# Altium schematic sheet Sheet1.SchDoc
size A4; DocumentNumber: 1; SheetNumber: 1; SheetTotal: 2
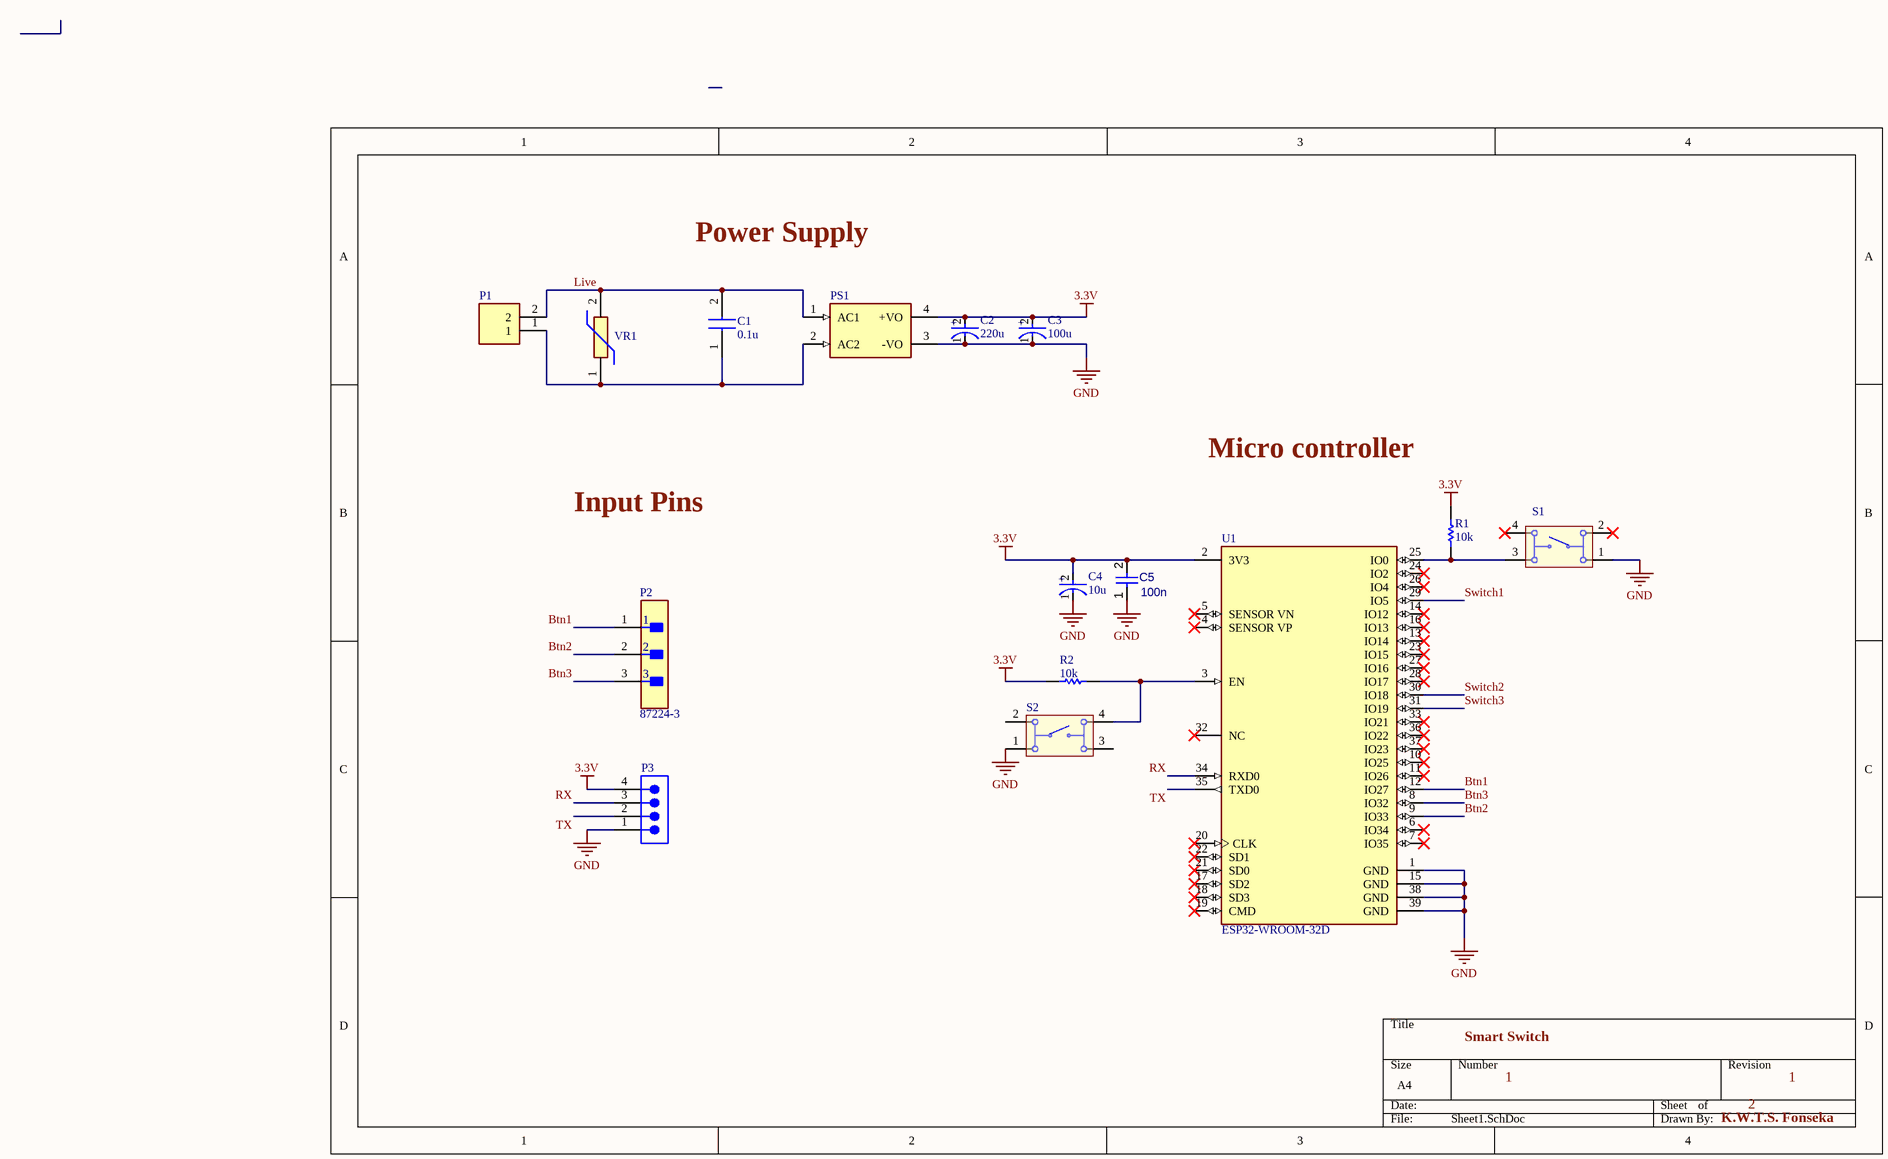
[diagram p0: Sheet1.SchDoc]

## Parts
C1  0.1u  [B32922X_(18_X_5)]
C2  220u  [FP-RAD-TH-D_6_3_0_5-L_11-MFG]
C3  100u  [FP-UKL1A101KED1TD-MFG]
C4  10u  [FP-T491A106M010AT-MFG]
C5  100n  [CAPC2013X95X50LL10T25]
P1  282841-2  [TE_282841-2]  (value not drawn)
P2  87224-3  [FP-87224-3-MFG]
P3  TSW-104-08-L-S  [SMTC-TSW-104-08-X-S]  (value not drawn)
PS1  HLK-PM03  [CONV_HLK-PM03]  (value not drawn)
R1  10k  [RESC2013X70X40ML20T20]
R2  10k  [RESC2013X70X40ML20T20]
S1  430471025826  [430471025826]  (value not drawn)
S2  430471025826  [430471025826]  (value not drawn)
U1  ESP32-WROOM-32D  [FP-ESP32-WROOM-32D-MFG]
VR1  MOV-10D561K  [MOV10D561K]  (value not drawn)

## Nets
3.3V: C2.2(A) C3.2(A) C4.2(A) C5.2 P3.4 PS1.4(+VO) R1.2 R2.1 U1.2(3V3)
GND: C2.1(C) C3.1(C) C4.1(C) C5.1 P3.1 PS1.3(-VO) S1.1 S2.1 U1.1(GND) U1.15(GND) U1.38(GND) U1.39(GND)
Btn1: P2.1 U1.12(IO27)
Btn2: P2.2 U1.9(IO33)
Btn3: P2.3 U1.8(IO32)
Live: C1.2 P1.2 PS1.1(AC1) VR1.2
RX: P3.3 U1.34(RXD0)
Switch1: U1.29(IO5)
Switch2: U1.30(IO18)
Switch3: U1.31(IO19)
TX: P3.2 U1.35(TXD0)
NetC1_1: C1.1 P1.1 PS1.2(AC2) VR1.1
NetR1_1: R1.1 S1.3 U1.25(IO0)
NetR2_2: R2.2 S2.4 U1.3(EN)

Not connected (* = marked no-connect by the designer): S1 2* 4*; S2 2 3; U1 4(SENSOR_VP)* 5(SENSOR_VN)* 6(IO34)* 7(IO35)* 10(IO25)* 11(IO26)* 13(IO14)* 14(IO12)* 16(IO13)* 17(SD2)* 18(SD3)* 19(CMD)* 20(CLK)* 21(SD0)* 22(SD1)* 23(IO15)* 24(IO2)* 26(IO4)* 27(IO16)* 28(IO17)* 32(NC)* 33(IO21)* 36(IO22)* 37(IO23)*

## Notes on the sheet
- Power Supply
- Micro controller
- Input Pins
- Smart Switch
- 1
- K.W.T.S. Fonseka
- (in symbol CMP-03017-000010-1) +
- (in symbol CMP-05427-001329-1) +
- (in symbol CMP-12462-000006-1) +

## Library data of the parts
C1 = B32922X2104K000: Safety Capacitor; Manufacturer_Name: TDK; Datasheet Link: https://product.tdk.com/system/files/dam/doc/product/capacitor/film/emi/data_sheet/20/20/db/fc_2009/x2_b32921_923_xy.pdf; Height: 10.5mm; Manufacturer_Part_Number: B32922X2104K000; Mouser Part Number: 871-B32922X2104K000; Mouser Price/Stock: https://www.mouser.co.uk/ProductDetail/EPCOS-TDK/B32922X2104K000?qs=TuK3vfAjtkWDVip5zaCELA%3D%3D; Arrow Part Number: B32922X2104K000; Arrow Price/Stock: https://www.arrow.com/en/products/b32922x2104k000/epcos-tdk?region=nac
C2 = CMP-05427-001329-1: Aluminum Electrolytic Capacitors (Radial Lead Type) 220uF ±20% 10V; Ripple Current: 455mA; Dielectric Material: Aluminium; Leakage Current: 10nA; Life (Hours): 2000Hour; Impedance: 130mR; Dissipation Factor: 0.19%; Lead Diameter: 0.5mm; Lead Length: 17mm; Outside Diameter: 6mm; Contact Plating: Tin; Lead Pitch: 2.5mm; Voltage: 10V; Max Operating Temperature: 105°C; Termination: Radial; Mount: Through Hole; Height: 11.2mm; RoHS Compliant: Yes; Voltage Rating (DC): 10V; Number of Pins: 2; Case/Package: Radial; Diameter: 6mm; ESR (Equivalent Series Resistance): 130mR; Construction: RADIAL; Lead Free: Lead Free; Min Operating Temperature: -40°C; Height - Seated (Max): 0.5inch; Capacitance: 220uF; Radiation Hardening: No; Voltage Rating: 10V; Length: 11mm; Ripple Current (AC): 455mA; Package Quantity: 200; Packaging: Bulk; Tolerance: 20%; Series: FM
C3 = CMP-12462-000006-1: CAP ALUM 100UF 10% 10V RADIAL; Manufacturer: Nichicon; Manufacturer Part Number: UKL1A101KED1TD; Dissipation Factor: 15%; Life: 2000Hours; Ripple Current: 180mA; Material: Aluminum; Leakage Current: 2uA; ComponentLink2Description: Datasheet; Value: 100uF; Digikey Description: CAP ALUM 100UF 10% 10V RADIAL; Temperature Range High: +85°C; RoHS: TRUE; Tolerance: 10%; Category: Cap; Device Class L1: Passive Components; Device Class L2: Capacitors; Package: 0; Height: 12mm; Octopart: https://octopart.com/ukl1a101ked1td-nichicon-20309866; Temperature: -40°C to +85°C; Capacitance: 100uF; Temperature Range Low: -40°C; Lead Free: Yes; Voltage Rating: 10V; Device Class L3: Aluminum Electrolytic Capacitors; ComponentLink2URL: https://www.nichicon.co.jp/english/products/pdfs/e-ukl.pdf; Automotive: No
C4 = CMP-03017-000010-1: CAP TANT 10UF 20% 10V 1206; Leakage Current: 1uA; Dissipation Factor: 6%; Dielectric Material: Tantalum; Polarity: Polar; Life (Hours): 2000Hour; ESR (Equivalent Series Resistance): 4R; Number of Pins: 2; Package Quantity: 2000; Depth: 1.6mm; Radiation Hardening: No; Mount: Surface Mount; Case/Package: 1206; Features: General Purpose; Case Code (Imperial): 1206; Voltage Rating: 10V; Series: T491; Case Code (Metric): 3216; Height: 1.6mm; Voltage Rating (DC): 10V; Width: 0.063inch; Lead Pitch: 1.2mm; Length: 3.2mm; Height - Seated (Max): 0.071inch; Capacitance: 10uF; Size: 1.6mm; Min Operating Temperature: -55°C; Packaging: Tape and Reel; Weight: 0.000571oz; Construction: Flat; Voltage: 10V; Tolerance: 20%; Termination: SMD/SMT; Max Operating Temperature: 125°C; Lead Free: Lead Free; REACH SVHC: No SVHC; RoHS Compliant: Yes
C5 = CMP-001-00018-6: Chip Capacitor, 100 nF, +/- 10%, 50 V, 0805 (2012 Metric); Voltage Rating: 50V; Value: 100nF; Capacitor Type: Ceramic; Case/Package: 0805; Min Operating Temperature: -55°C; Tolerance: 10%; RoHS Compliant: True; Max Operating Temperature: 125°C; Pins: 2; Mounting Technology: SM
P1 = CMP-002-00071-1: Conn Terminal Block 2 POS 5.08mm Solder ST Thru-Hole 17.5A/Contact; MF: TE Connectivity; Source: 282841-2.SchLib; Price: None; Purchase-URL: https://pricing.snapeda.com/search/part/282841-2/?ref=eda; MP: 282841-2; Value: *; EU_RoHS_Compliance: Compliant with Exemptions; Case/Package: None; SnapEDA_Link: https://www.snapeda.com/parts/282841-2/TE+Connectivity+AMP+Connectors/view-part/?ref=snap; Design Item ID: 282841-2; Component Type: Standard; Pins: 2; Check_prices: https://www.snapeda.com/parts/282841-2/TE+Connectivity+AMP+Connectors/view-part/?ref=eda; Availability: In Stock
P2 = CMP-2000-05697-2: CONN HEADER VERT 3POS 2.54MM; Number of Positions: 3; Gasket: No (Without); High Speed Serial Data Connector: No; Current Rating: 3A; Contact Post Length: 0.125inch; PCB Thickness: 1.397mm; PCB Mount Retention: Without; Connector Type: Plug; Approvals: CSA; PCB Mounting Orientation: Vertical; Pitch: 2.54mm; Mating Alignment: No (Without); Housing Color: Black; Contact Gender: Male; Length: 7.21mm; Max Operating Temperature: 105°C; Strain Relief: No (Without); Contact Material: Bronze; Row Spacing: 2.54mm; Series: AMPMODU MOD II; Board Standoff: No (Without); Package Quantity: 520; Radiation Hardening: No; Contact Protection: No (Without); Stabilizers: No (Without); Number of Rows: 1; Contact Mating Length: 8.08mm; Contact Shape: Square; Depth: 2.54mm; Contact Current Rating: 3A; Flammability Rating: UL94 V-0; Packaging: Carton; Number of Contacts: 3; Orientation: Straight; Mount: Through Hole; Keyed: No; Contact Type: Male Pin; Housing Material: Thermoplastic; High Temperature Housing: No; ELV: Compliant; Contact Plating: Gold; Termination: Through Hole; Selectively Loaded: No (Without); Lead Free: Lead Free; Min Operating Temperature: -65°C; Mating Connector Lock: No (Without); Color: Black; RoHS Compliant: Yes
P3 = CMP-1024-00358-1: 0.025" SQ Post Header, Through-hole, Vertical, -55 to 125 degC, 2.54 mm Pitch, 4-Pin, Male, RoHS; Manufacturer: Samtec; Pitch: 2.54 mm; PartNumber: TSW-104-08-L-S; RoHS: True; Temperature Range: -55 to 125 degC; PackageDescription: .025[0.64] SQ. Post Terminal Strip Assembly; Orientation: Vertical; ComponentLink2URL: http://www.samtec.com/documents/webfiles/pdf/TSW_TH.PDF; ComponentLink1Description: Manufacturer URL; ComponentLink2Description: Datasheet; PackageVersion: DM, 8/1988; ComponentLink3URL: http://www.samtec.com/documents/webfiles/cpdf/TSW-XXX-XX-XXX-X-XX-XXX-MKT.pdf; Mounting Technology: Through-hole; PackageReference: TSW-104-08-X-S; ComponentLink3Description: Package Specification; ComponentLink1URL: http://www.samtec.com; DatasheetVersion: F-214
PS1 = CMP-005-000000-1: MF: Hi-link; Design Item ID: HLK-PM03; Availability: Not in stock; SnapEDA_Link: https://www.snapeda.com/parts/HLK-PM03/Hi-link/view-part/?ref=snap; Pin Count: 4; Value: *; Package: Package; Component Type: Standard; Source: HLK-PM03.SchLib; Price: None; MP: HLK-PM03; Check_prices: https://www.snapeda.com/parts/HLK-PM03/Hi-link/view-part/?ref=eda
R1 R2 = CMP-2001-04376-1: ERJ-6ENF1002V; Manufacturer: Panasonic; Part Number: ERJ-6ENF1002V
S1 S2 = CMP-1452-00022-1: WS-TASV SMD Tact Switch 6X6 mm; Manufacturer: Wuerth Elektronik; NoPins: 04; ComponentLink1Description: Manufacturer URL; PackageReference: 430471025826; ComponentLink2Description: Datasheet; ComponentLink2URL: http://katalog.we-online.de/em/datasheet/4304x1.pdf; ComponentLink1URL: http://www.we-online.com; PartNumber: 430471025826
U1 = CMP-194065-000003-1: WIFI MODULE 32MBITS SPI FLASH; Manufacturer: Espressif Systems; Max Supply Voltage: 3.6V; Nominal Supply Current: 500mA; Max Frequency: 2484MHz; Number Of Adc Channels: 16; Number Of Gpio: 32; Interface: I2C,SPI,UART,Ethernet,I2S,Other; Data Rate: 150Mbits/s; Min Supply Voltage: 3V; Bandwidth: 72MHz; Sensitivity: -98dBm; Octopart: https://octopart.com/esp32-wroom-32d-espressif+systems-91040050; Package: ESP32-WROOM-32D; ComponentLink2URL: https://www.espressif.com/sites/default/files/documentation/esp32-wroom-32d_esp32-wroom-32u_datasheet_en.pdf; Lead Free: Yes; Category: UNK; Mouser Description: Wi-Fi/BT BLE Module ESP32-D0WD, SPI Flash, UART, P; Device Class L1: Integrated Circuits (ICs); RoHS: TRUE; Temperature Range Low: -40°C; ComponentLink2Description: Datasheet; Digikey Description: WIFI MODULE 32MBITS SPI FLASH; Height: 3.2mm; Temperature: -40°C to +85°C; Manufacturer Part Number: ESP32-WROOM-32D; Device Class L3: Transceivers; Device Class L2: RF Semiconductors and Devices; Temperature Range High: +85°C; Automotive: No
VR1 = MOV-10D561K: Varistor; Manufacturer_Name: Bourns; Datasheet Link: https://www.bourns.com/docs/Product-Datasheets/MOV10D.pdf; Height: 15.5mm; Manufacturer_Part_Number: MOV-10D561K; Mouser Part Number: 652-MOV-10D561K; Mouser Price/Stock: https://www.mouser.co.uk/ProductDetail/Bourns/MOV-10D561K?qs=lgttKnAd%252B2ArrqGQgWwr6w%3D%3D; Arrow Part Number: MOV-10D561K; Arrow Price/Stock: https://www.arrow.com/en/products/mov-10d561k/bourns?region=nac